# EAGLE design open-lux-B (EAGLE 6.5.0)
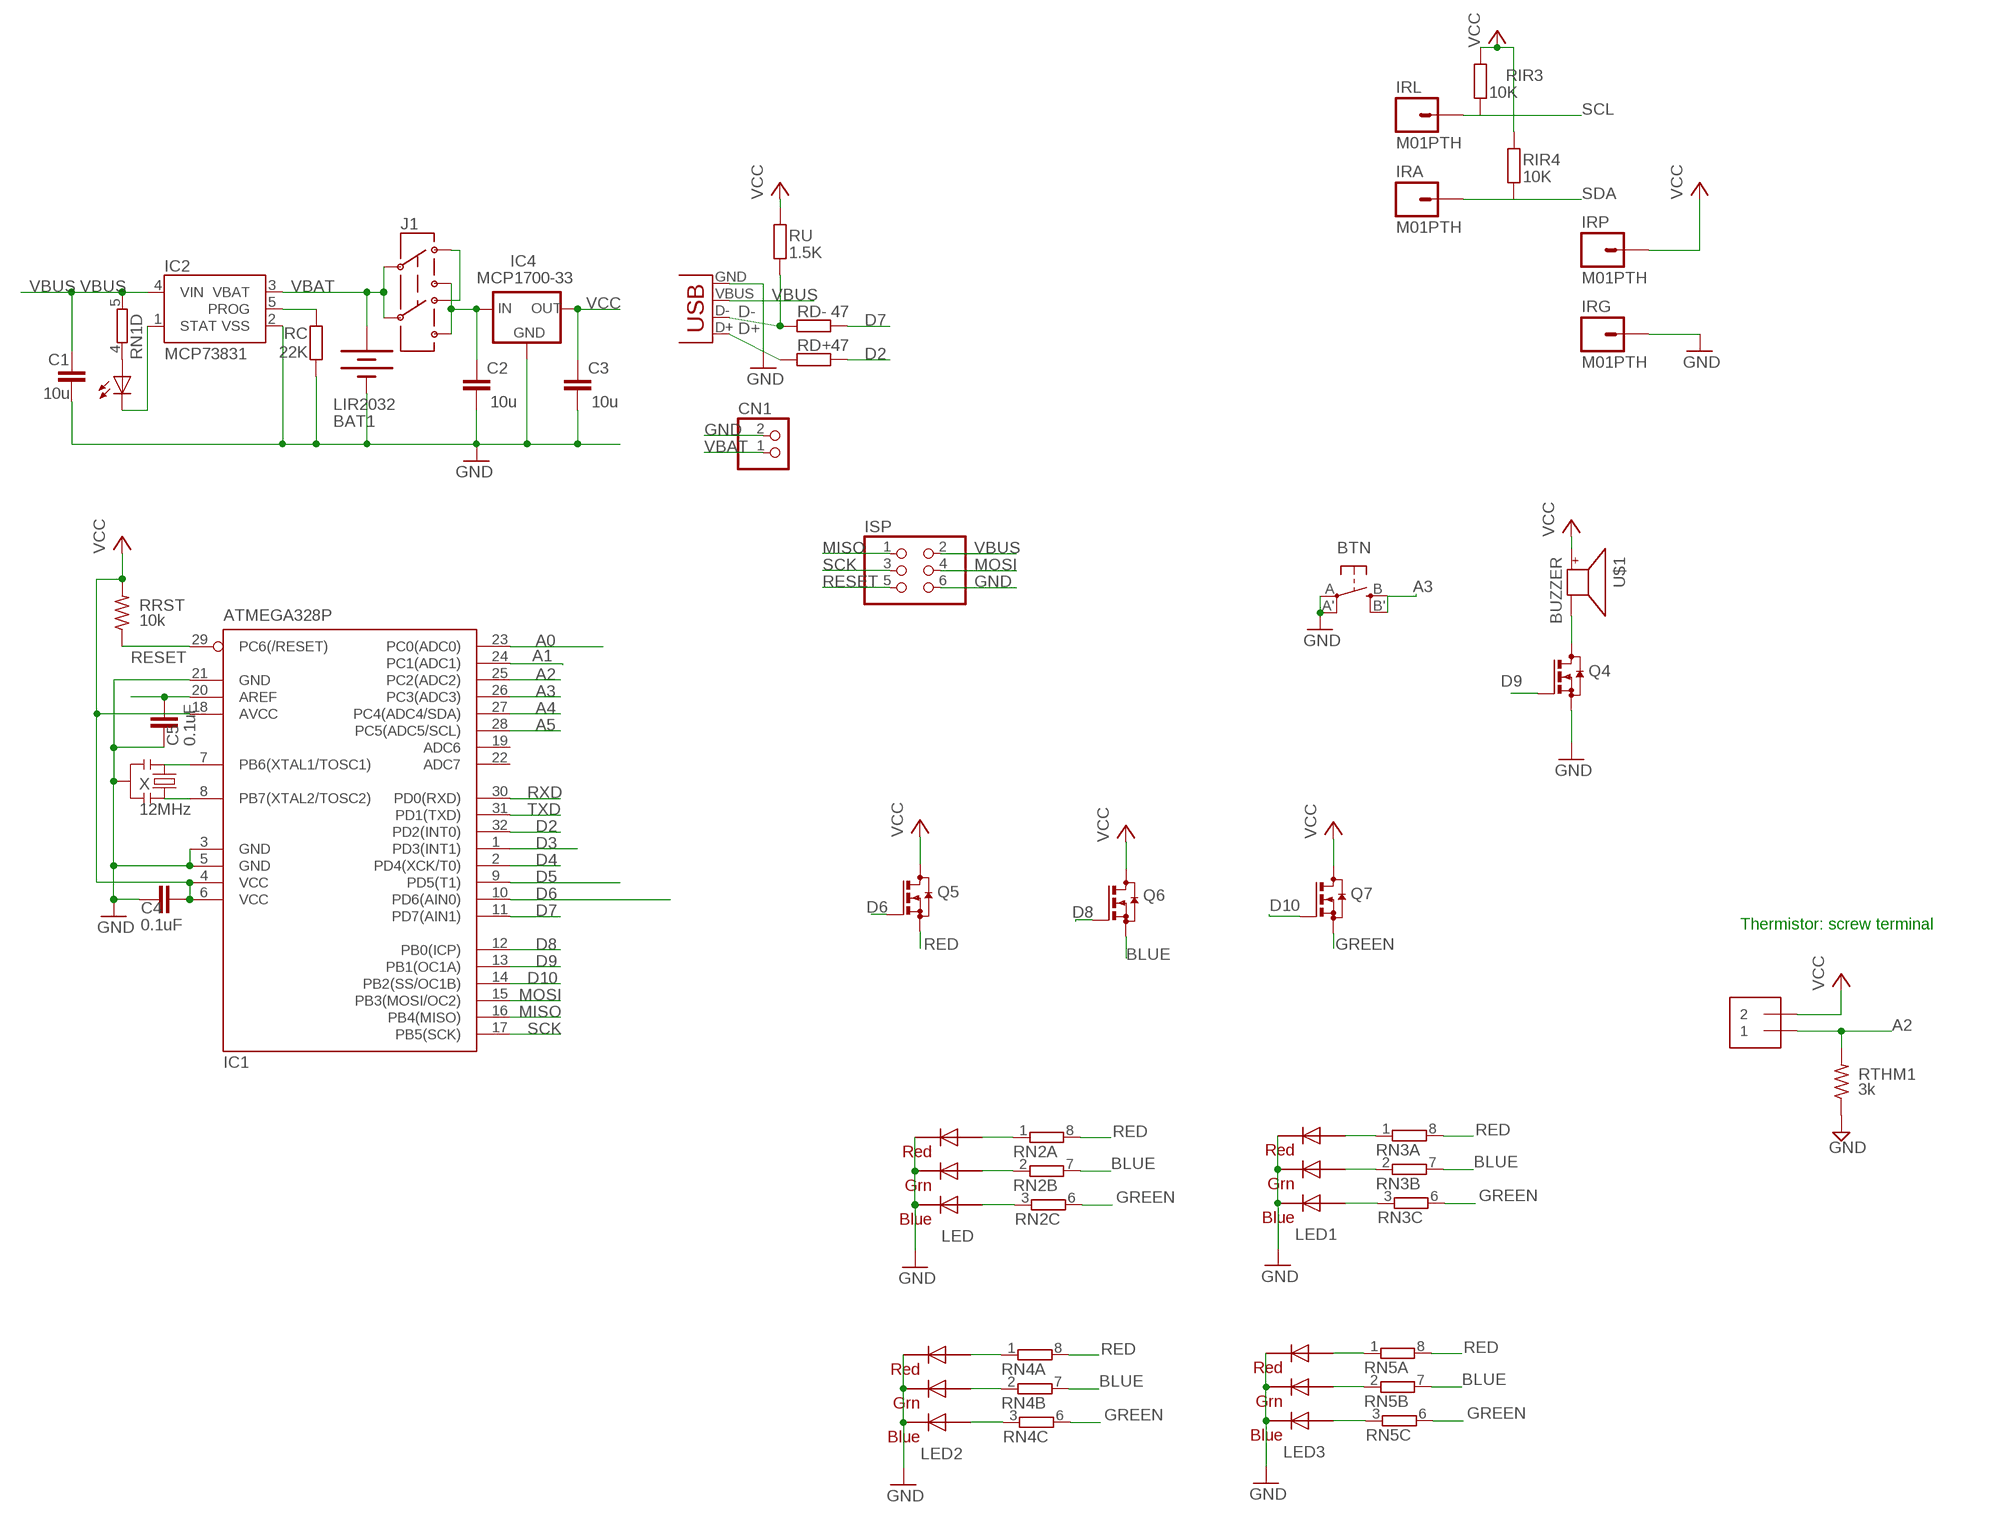
[diagram p0: schematic, sheet 1, part 1 of 2]
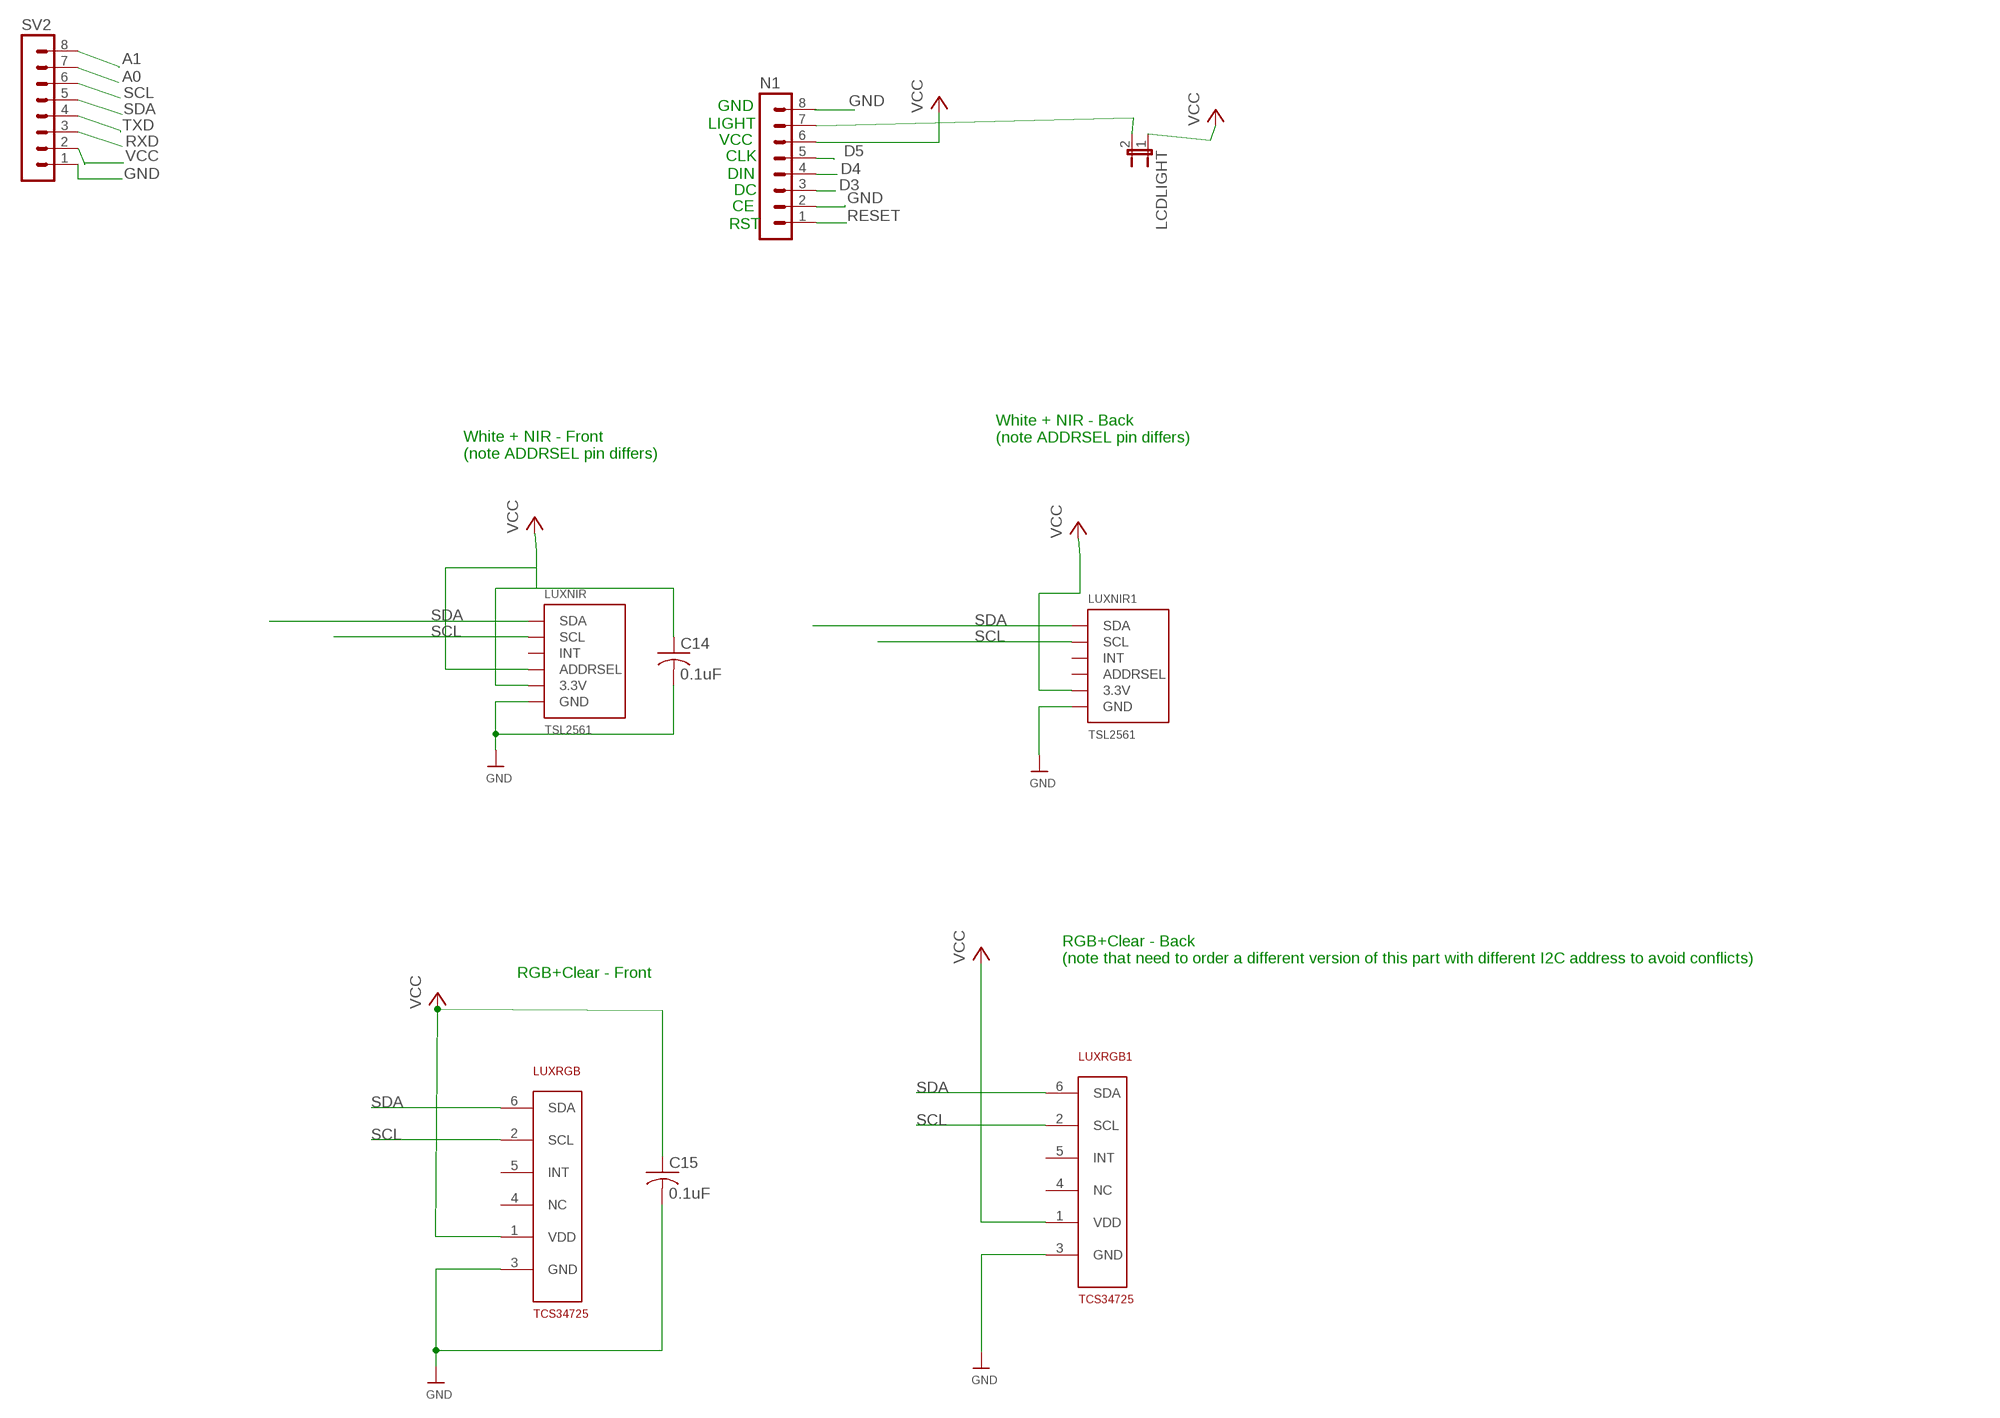
[diagram p1: schematic, sheet 1, part 2 of 2]

## Parts
BAT1  LIR2032  BATTERYBATTCOM_20MM_PTH_SMT  [BATTCOM_20MM_PTH_SMT]
BTN  EVQQ2  [EVQ-Q2]
C1  10u  C-EUC0805  [C0805]
C2  10u  C-EUC0805  [C0805]
C3  10u  C-EUC0805  [C0805]
C4  0.1uF  C-EUC0805  [C0805]
C5  0.1uF  C-EUC0805  [C0805]
C14  0.1uF  C-USC0805  [C0805]
C15  0.1uF  C-USC0805  [C0805]
CHG  0805  LEDCHIPLED_0805  [CHIPLED_0805]
CN1  JST_2PIN-SMT-RA  [JST-PH-2-SMT-RA]
IC1  ATMEGA328P  MEGA8-AI  [TQFP32-08]
IC2  MCP73831  [SOT23-5]
IC4  MCP1700-33  MCP1700SOT233  [SOT23]
IRA  M01PTH  [1X01]
IRG  M01PTH  [1X01]
IRL  M01PTH  [1X01]
IRP  M01PTH  [1X01]
ISP  PINHD-2X3  [2X03]
J1  AYZ0202  [AYZ0202]
LCDLIGHT  JP1E  [JP1]
LED  RGBLED5050  [RGBLED5050]
LED1  RGBLED5050  [RGBLED5050]
LED2  RGBLED5050  [RGBLED5050]
LED3  RGBLED5050  [RGBLED5050]
LUXNIR  TSL2561  [TSL2561_FN@1]
LUXNIR1  TSL2561  [TSL2561_FN@1]
LUXRGB  TCS34725  [DFN-6]
LUXRGB1  TCS34725  [DFN-6]
N1  MA08-1  [MA08-1]
Q4  BSS123  [SOT23]
Q5  BSS123  [SOT23]
Q6  BSS123  [SOT23]
Q7  BSS123  [SOT23]
RC  22K  R-EU_R0805  [R0805]
RD+  47  R-EU_R0805  [R0805]
RD-  47  R-EU_R0805  [R0805]
RIR3  10K  R-EU_R0805  [R0805]
RIR4  10K  R-EU_R0805  [R0805]
RN1  4R-NEXB38V  [EXB38V]
RN2  4R-NEXB38V  [EXB38V]
RN3  4R-NEXB38V  [EXB38V]
RN4  4R-NEXB38V  [EXB38V]
RN5  4R-NEXB38V  [EXB38V]
RRST  10k  R-US_R0805  [R0805@1]
RTHM1  3k  R-US_R0805  [R0805@1]
RU  1.5K  R-EU_R0805  [R0805]
SV2  MA08-1  [MA08-1]
THM1  1X2-3.5MM  [1X2-3.5MM]
U$1  BUZZER  [SMT-8585-BUZZER]
X  12MHz  RESONATORSMD  [RESONATOR-SMD]
X1  USBSMD  [USB-MINIB]

## Nets
A0: IC1.23(PC0(ADC0)) SV2.7
A1: IC1.24(PC1(ADC1)) SV2.8
A2: IC1.25(PC2(ADC2)) RTHM1.2 THM1.1
A3: BTN.B'(S1) BTN.B(S) IC1.26(PC3(ADC3))
A4: IC1.27(PC4(ADC4/SDA))
A5: IC1.28(PC5(ADC5/SCL))
AREF: C5.2 IC1.20(AREF)
BLUE: Q6.2(S) RN2.7 RN3.7 RN4.7 RN5.7
D2: IC1.32(PD2(INT0)) RD+.2
D3: IC1.1(PD3(INT1)) N1.3
D4: IC1.2(PD4(XCK/T0)) N1.4
D5: IC1.9(PD5(T1)) N1.5
D6: IC1.10(PD6(AIN0)) Q5.1(G)
D7: IC1.11(PD7(AIN1)) RD-.2
D8: IC1.12(PB0(ICP)) Q6.1(G)
D9: IC1.13(PB1(OC1A)) Q4.1(G)
D10: IC1.14(PB2(SS/OC1B)) Q7.1(G)
D+: RD+.1 X1.D+
D-: RD-.1 RU.1 X1.D-
GND: BAT1.P$1(-) BTN.A'(P1) BTN.A(P) C1.2 C2.2 C3.2 C4.1 C5.1 C14.2 C15.2 CN1.2 IC1.3(GND) IC1.5(GND) IC1.21(GND) IC2.2(VSS) IC4.1(GND) IRG.1 ISP.6 LED1.4(BLUE_C) LED1.5(RED_C) LED1.6(GREEN_C) LED2.4(BLUE_C) LED2.5(RED_C) LED2.6(GREEN_C) LED3.4(BLUE_C) LED3.5(RED_C) LED3.6(GREEN_C) LED.4(BLUE_C) LED.5(RED_C) LED.6(GREEN_C) LUXNIR1.VSS(GND) LUXNIR.VSS(GND) LUXRGB1.3(GND) LUXRGB.3(GND) N1.2 N1.8 Q4.2(S) RC.1 RTHM1.1 SV2.1 X1.GND X.2
GREEN: Q7.2(S) RN2.6 RN3.6 RN4.6 RN5.6
MISO: IC1.16(PB4(MISO)) ISP.1
MOSI: IC1.15(PB3(MOSI/OC2)) ISP.4
N$1: J1.3 J1.6
N$2: IC1.7(PB6(XTAL1/TOSC1)) X.1
N$3: IC1.8(PB7(XTAL2/TOSC2)) X.3
N$4: LED.3(BLUE_A) RN2.3
N$5: CHG.C IC2.1(STAT)
N$6: IC2.5(PROG) RC.2
N$7: Q4.3(D) U$1.-
N$8: LCDLIGHT.2 N1.7
N$9: LED.1(GREEN_A) RN2.2
N$10: CHG.A RN1.4
N$11: LED.2(RED_A) RN2.1
N$12: LED1.3(BLUE_A) RN3.3
N$13: LED1.1(GREEN_A) RN3.2
N$14: LED1.2(RED_A) RN3.1
N$15: LED2.3(BLUE_A) RN4.3
N$16: LED2.1(GREEN_A) RN4.2
N$17: LED2.2(RED_A) RN4.1
N$18: LED3.3(BLUE_A) RN5.3
N$19: LED3.1(GREEN_A) RN5.2
N$20: LED3.2(RED_A) RN5.1
RED: Q5.2(S) RN2.8 RN3.8 RN4.8 RN5.8
RESET: IC1.29(PC6(/RESET)) ISP.5 N1.1 RRST.1
RXD: IC1.30(PD0(RXD)) SV2.3
SCK: IC1.17(PB5(SCK)) ISP.3
SCL: IRL.1 LUXNIR1.CLK(SCL) LUXNIR.CLK(SCL) LUXRGB1.2(SCL) LUXRGB.2(SCL) RIR3.1 SV2.6
SDA: IRA.1 LUXNIR1.DATA(SDA) LUXNIR.DATA(SDA) LUXRGB1.6(SDA) LUXRGB.6(SDA) RIR4.1 SV2.5
TXD: IC1.31(PD1(TXD)) SV2.4
VBAT: BAT1.P$2(+) CN1.1 IC2.3(VBAT) J1.2 J1.5
VBUS: C1.1 IC2.4(VIN) ISP.2 RN1.5 X1.VBUS
VCC: C3.1 C4.2 C14.1 C15.1 IC1.4(VCC) IC1.6(VCC) IC1.18(AVCC) IC4.2(OUT) IRP.1 LCDLIGHT.1 LUXNIR1.VDD(3.3V) LUXNIR.ADR(ADDRSEL) LUXNIR.VDD(3.3V) LUXRGB1.1(VDD) LUXRGB.1(VDD) N1.6 Q5.3(D) Q6.3(D) Q7.3(D) RIR3.2 RIR4.2 RRST.2 RU.2 SV2.2 THM1.2 U$1.+
VDD: C2.1 IC4.3(IN) J1.1 J1.4
Unconnected: IC1.19(ADC6) IC1.22(ADC7) LUXNIR1.ADR(ADDRSEL) LUXNIR1.INT LUXNIR.INT LUXRGB1.4(NC) LUXRGB1.5(INT) LUXRGB.4(NC) LUXRGB.5(INT) RN1.1 RN1.2 RN1.3 RN1.6 RN1.7 RN1.8 RN2.4 RN2.5 RN3.4 RN3.5 RN4.4 RN4.5 RN5.4 RN5.5

## Notes on the sheet
- GND
- LIGHT
- VCC
- CLK
- DIN
- DC
- CE
- RST
- White + NIR - Back
  (note ADDRSEL pin differs)
- White + NIR - Front
  (note ADDRSEL pin differs)
- Thermistor: screw terminal
- RGB+Clear - Back 
  (note that need to order a different version of this part with different I2C address to avoid conflicts)
- RGB+Clear - Front

## Library data of the parts
BAT1 = SparkFunNew:BATTERY: Battery Holders Various common sizes : AA, AAA, 20mm coin cell and 12mm coin cell.
BTN = adafruit:EVQQ2: SMT 6mm switch, EVQQ2 series http://www.ladyada.net/library/eagle
C1-C3 = resistor:C-EU: CAPACITOR, European symbol
C4 C5 = rcl:C-EU: CAPACITOR, European symbol
C14 C15 = adafruit:C-US: CAPACITOR, American symbol
CHG = led:LED: LED OSRAM: - CHIPLED LG R971, LG N971, LY N971, LG Q971, LY Q971, LO R971, LY R971 LH N974, LH R974 LS Q976, LO Q976, LY Q976 LO Q996 - Hyper CHIPLED LW Q18S LB Q993, LB Q99A, LB R99A - SideLED LS A670, LO A670, LY A670, LG A670, LP A670 LB A673, LV A673, LT A673, LW A673 LH A674 LY A675 LS A676, LA A676, LO A676, LY A676, LW A676 LS A679, LY A679, LG A679 - Hyper Micro SIDELED® LS Y876, LA Y876, LO Y876, LY Y876 LT Y87S - SmartLED LW L88C, LW L88S LB L89C, LB L89S, LG L890 LS L89K, LO L89K, LY L89K LS L896, LA L896, LO L896, LY L896 - TOPLED LS T670, LO T670, LY T670, LG T670, LP T670 LSG T670, LSP T670, LSY T670, LOP T670, LYG T670 LG T671, LOG T671, LSG T671 LB T673, LV T673, LT T673, LW T673 LH T674 LS T676, LA T676, LO T676, LY T676, LB T676, LH T676, LSB T676, LW T676 LB T67C, LV T67C, LT T67C, LS T67K, LO T67K, LY T67K, LW E67C LS E67B, LA E67B, LO E67B, LY E67B, LB E67C, LV E67C, LT E67C LW T67C LS T679, LY T679, LG T679 LS T770, LO T770, LY T770, LG T770, LP T770 LB T773, LV T773, LT T773, LW T773 LH T774 LS E675, LA E675, LY E675, LS T675 LS T776, LA T776, LO T776, LY T776, LB T776 LHGB T686 LT T68C, LB T68C - Hyper Mini TOPLED® LB M676 - Mini TOPLED Santana® LG M470 LS M47K, LO M47K, LY M47K Source: http://www.osram.convergy.de LUXEON: - LUMILED® LXK2-PW12-R00, LXK2-PW12-S00, LXK2-PW14-U00, LXK2-PW14-V00 LXK2-PM12-R00, LXK2-PM12-S00, LXK2-PM14-U00 LXK2-PE12-Q00, LXK2-PE12-R00, LXK2-PE12-S00, LXK2-PE14-T00, LXK2-PE14-U00 LXK2-PB12-K00, LXK2-PB12-L00, LXK2-PB12-M00, LXK2-PB14-N00, LXK2-PB14-P00, LXK2-PB14-Q00 LXK2-PR12-L00, LXK2-PR12-M00, LXK2-PR14-Q00, LXK2-PR14-R00 LXK2-PD12-Q00, LXK2-PD12-R00, LXK2-PD12-S00 LXK2-PH12-R00, LXK2-PH12-S00 LXK2-PL12-P00, LXK2-PL12-Q00, LXK2-PL12-R00 Source: www.luxeon.com KINGBRIGHT: KA-3528ASYC Source: www.kingbright.com
CN1 = adafruit:JST_2PIN: JST 2-Pin Connectors of various flavors SMT-RA (S2B-PH-SM4) 4UConnector #17311 SMT (B2B-PH-SM4) THM-RA (S2B-PH) THM (B2B-PH)
IC1 = atmel:MEGA8: MICROCONTROLLER 8 Kbytes FLASH, 1 kbytes SRAM, 512 bytes EEPROM, USART, 6-channel 10 bit ADC, 2-channel 8 bit ADC Pin compatible with Atmega48, ATMega88, ATMega168 Source: avr.lbr; MPN: ATMEGA8-16AU; OC_FARNELL: 9171371; OC_NEWARK: 73M8863
IC2 = SparkFunNew:MCP73831: Microchip's MCP73831 Miniature single cell, fully integrated Li-Ion, Li-polymer charge management controller http://ww1.microchip.com/downloads/en/DeviceDoc/21984a.pdf
IC4 = adafruit:MCP1700: VOLTAGE REGULATOR
IRA IRG IRL IRP = SparkFun-Connectors:M01: Header 1 Standard 1-pin 0.1" header. Use with straight break away headers (SKU : PRT-00116), right angle break away headers (PRT-00553), swiss pins (PRT-00743), machine pins (PRT-00117), and female headers (PRT-00115).
ISP = pinhead:PINHD-2X3: PIN HEADER
J1 = SparkFunNew:AYZ0202: SPDT Slide Switch Simple SMD single-pull double-throw slide switch. Good for less than 350mA power switch, switching UARTs between devices, etc. Spark Fun Electronics SKU : COM-00597
LCDLIGHT = jumper:JP1E: JUMPER
LED LED1-LED3 = adafruit:RGBLED: For 5050 RGB LEDs, the order of the LEDs may vary from one manufacturer to another!
LUXNIR LUXNIR1 = microbuilder:TSL2561: TSL2561 Light-To-Digital Sensor Mouser Part Numbers: CS (obsolete): 856-TSL2561CS DFN (cheapest): 856-TSL2561FN
LUXRGB LUXRGB1 = dwbLibrary:TCS34725
N1 SV2 = con-lstb:MA08-1: PIN HEADER; OC_FARNELL: unknown; OC_NEWARK: unknown
Q4-Q7 = transistor-small-signal:BSS123: N-CHANNEL MOS FET
RC RD+ RD- RIR3 RIR4 RU = rcl:R-EU_: RESISTOR, European symbol
RN1-RN5 = resistor-dil:4R-N: Array Chip Resistor Source: RS Component / Phycomp; OC_FARNELL: unknown; OC_NEWARK: unknown
RRST RTHM1 = rcl:R-US_: RESISTOR, American symbol
THM1 = adafruit:1X2: 3.5mm Terminal block http://www.ladyada.net/library/pcb/eaglelibrary.html
U$1 = adafruit:BUZZER
X = SparkFunNew:RESONATOR: Resonator Small SMD resonator. This is the itty bitty 10/20MHz resonators with built in caps. CSTCE10M0G55 and CSTCE20M0V53. Footprint has been reviewed closely but hasn't been tested yet.
X1 = SparkFun:USB: USB Connectors USB-B-PTH is fully proven SKU : PRT-00139 USB-miniB is fully proven SKU : PRT-00587 USB-A-PCB is untested. USB-A-H is throughly reviewed, but untested. Spark Fun Electronics SKU : PRT-00437 USB-B-SMT is throughly reviewed, but untested. Needs silkscreen touching up. USB-A-S has not been used/tested USB-MB-H has not been used/tested

## Net classes
0 default: width 0.203 mm, clearance 0.203 mm
1 power: width 0.254 mm, clearance 0.203 mm

## Board
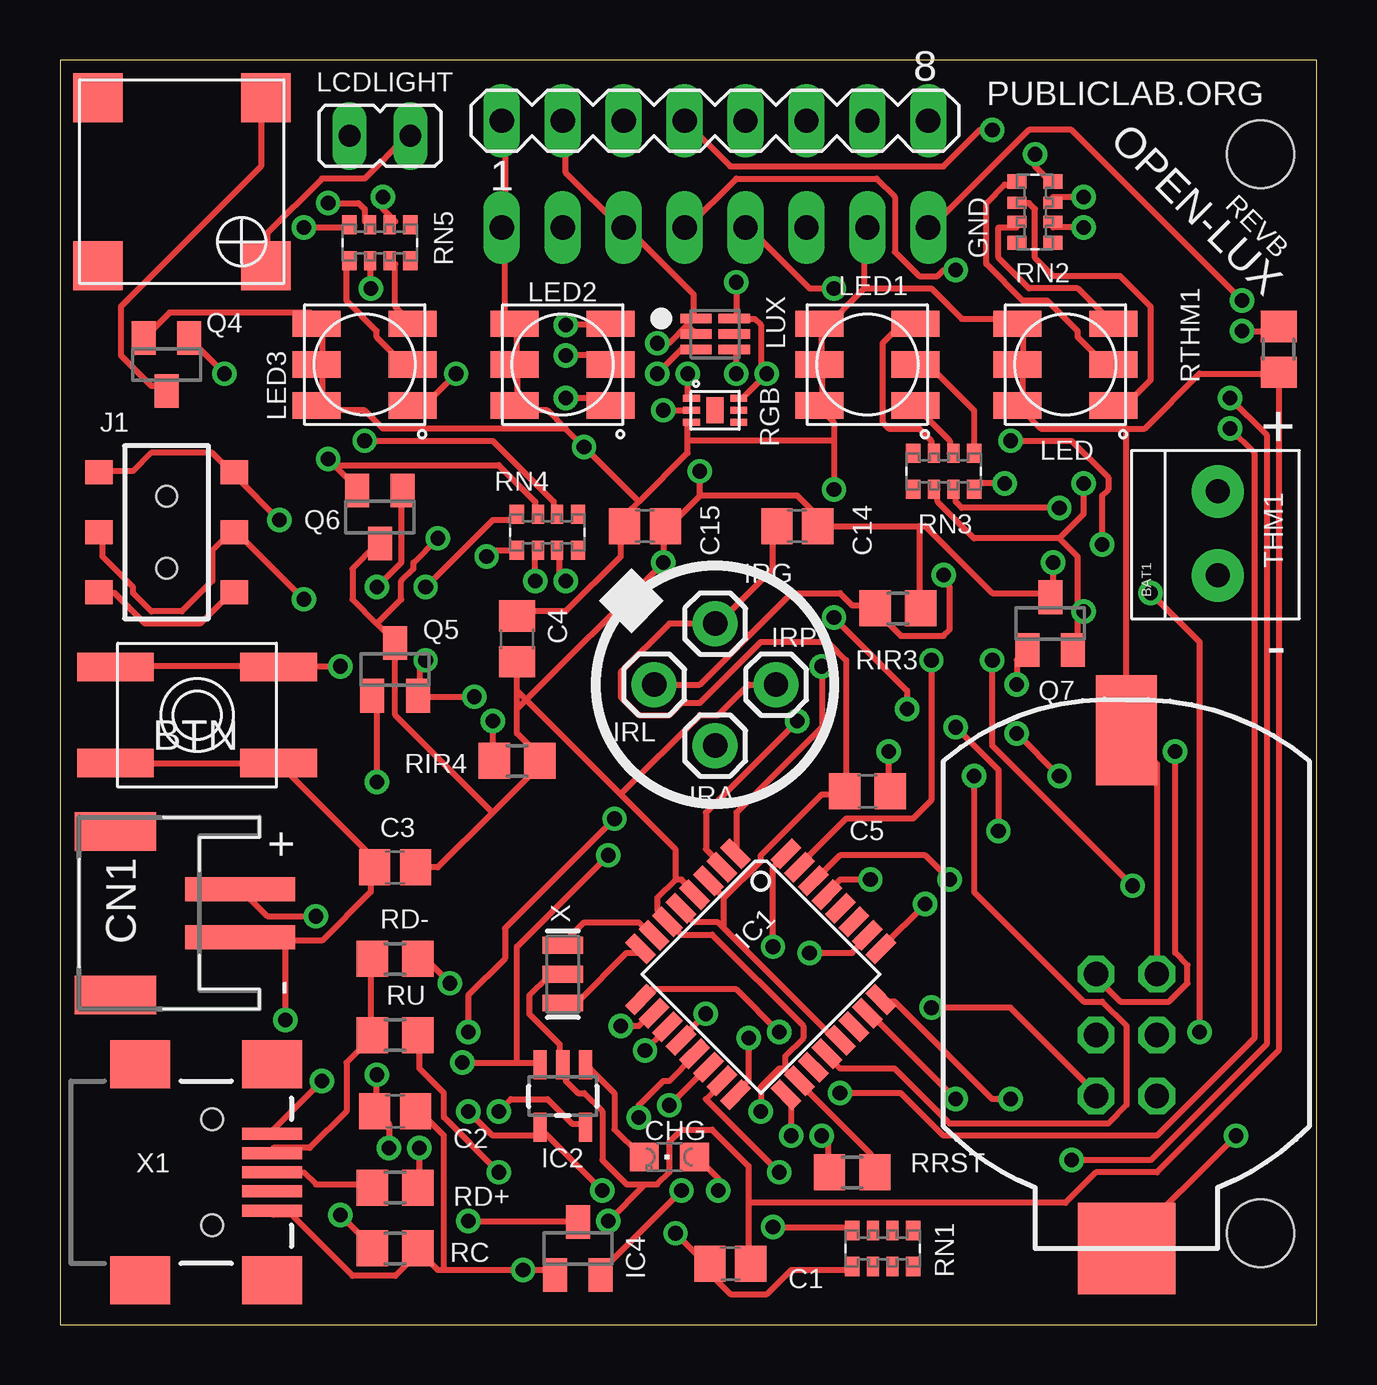
[diagram p2: board, top side]
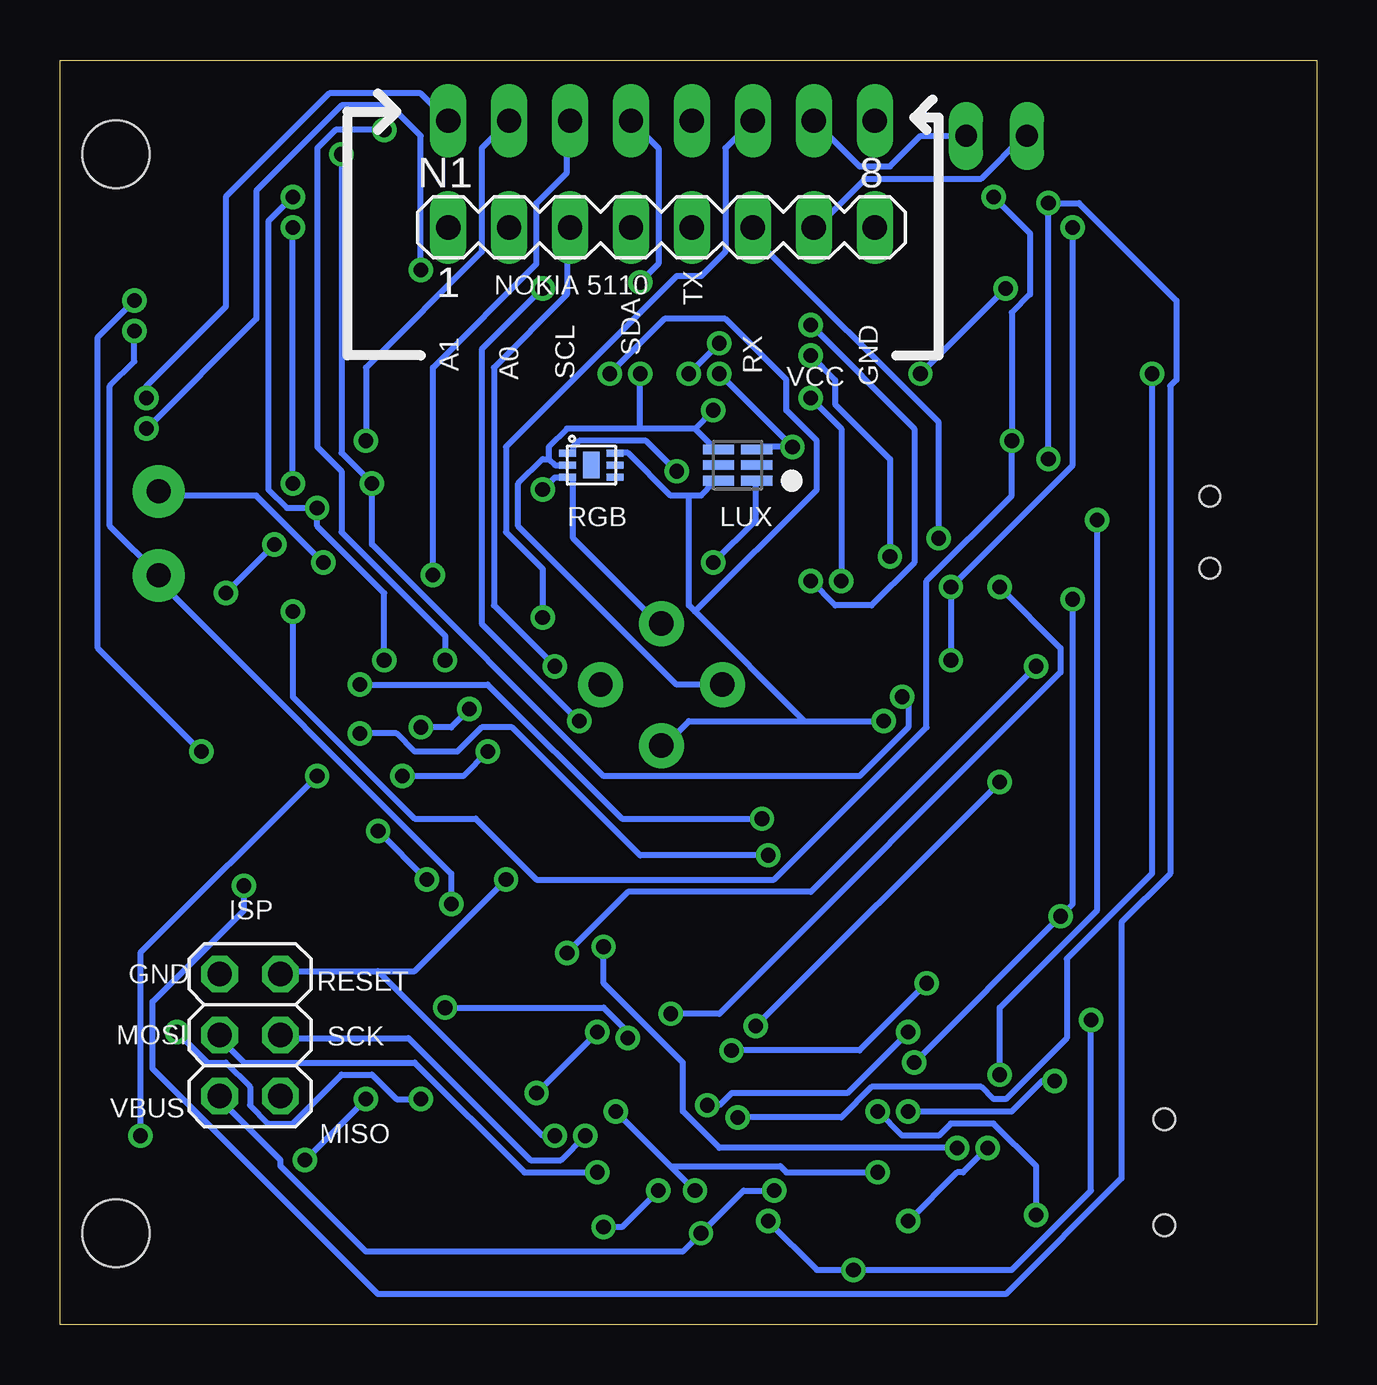
[diagram p3: board, bottom side, seen from below]

Size 52.38 x 52.7 mm. Coordinates in mm from the lower left corner, seen from the top.
Outline: 0,0 52.38,0 52.38,52.7 0,52.7 0,0
Copper layers (1*16): Top 0.035mm / dielectric 1.5mm / Bottom 0.035mm
Design rules "default": minimum track width 10mil, minimum drill 24mil, track to track 8mil, track to pad 8mil, pad to pad 8mil, via to via 8mil, smd to smd 8mil, copper to edge 40mil, drill to drill 8mil, minimum pad ring 10mil, minimum via ring 8mil, stop-mask expansion 4mil, vias tented up to drill 0mil, thermal gap 10mil
Holes 2.8 mm at 50.04,3.81 50.04,48.77

### Footprints (pad centres in the part's own frame; a part is rotated, then mirrored left to right if it is on the bottom)
BATTCOM_20MM_PTH_SMT = smd 4.572 x 2.54: P$1 0,0 | smd 3.81 x 4.064: P$2 21.59,0
EVQ-Q2 = smd 3.2 x 1.2: A -3.4,-2; A' 3.4,-2; B -3.4,2; B' 3.4,2
C0805 = smd 1.3 x 1.5: 1 -0.85,0; 2 0.85,0
C0805' = smd 1.3 x 1.5: 1 -0.95,0; 2 0.95,0
CHIPLED_0805 = smd 1.2 x 1.2: A 0,-1.05; C 0,1.05
JST-PH-2-SMT-RA = smd 1 x 4.6: 1 1,-3.7; 2 -1,-3.7 | smd 1.6 x 3.4: NC1 -3.4,1.5; NC2 3.4,1.5
TQFP32-08 = smd 1.27 x 0.559: 1 -4.293,2.8; 2 -4.293,2; 3 -4.293,1.2; 4 -4.293,0.4; 5 -4.293,-0.4; 6 -4.293,-1.2; 7 -4.293,-2; 8 -4.293,-2.8; 17 4.293,-2.8; 18 4.293,-2; 19 4.293,-1.2; 20 4.293,-0.4; 21 4.293,0.4; 22 4.293,1.2; 23 4.293,2; 24 4.293,2.8 | smd 0.559 x 1.27: 9 -2.8,-4.293; 10 -2,-4.293; 11 -1.2,-4.293; 12 -0.4,-4.293; 13 0.4,-4.293; 14 1.2,-4.293; 15 2,-4.293; 16 2.8,-4.293; 25 2.8,4.293; 26 2,4.293; 27 1.2,4.293; 28 0.4,4.293; 29 -0.4,4.293; 30 -1.2,4.293; 31 -2,4.293; 32 -2.8,4.293
SOT23-5 = smd 0.55 x 1.2: 1 -0.95,-1.3; 2 0,-1.3; 3 0.95,-1.3; 4 0.95,1.3; 5 -0.95,1.3
SOT23 = smd 1 x 1.4: 1 -0.95,-1.1; 2 0.95,-1.1; 3 0,1.1
1X01 = drill 1.016 pad 1.88: 1 0,0
2X03 = drill 1.016 octagon: 1 -2.54,-1.27; 2 -2.54,1.27; 3 0,-1.27; 4 0,1.27; 5 2.54,-1.27; 6 2.54,1.27
AYZ0202 = smd 1 x 1.15: 1 -2.5,2.825; 2 0,2.825; 3 2.5,2.825; 4 -2.5,-2.825; 5 0,-2.825; 6 2.5,-2.825 | hole 0.85: 1.5,0; -1.5,0
JP1 = drill 0.914 long: 1 0,-1.27; 2 0,1.27
RGBLED5050 = smd 2 x 1.1: 1 -2,1.7; 2 -2,0; 3 -2,-1.7; 4 2,-1.7; 5 2,0; 6 2,1.7
TSL2561_FN@1 = smd 1.3 x 0.4: ADR -0.8,0; CLK 0.8,-0.65; DATA 0.8,0.65; INT 0.8,0; VDD -0.8,0.65; VSS -0.8,-0.65
DFN-6 = smd 0.28 x 0.7: 1 -0.5,-0.988; 2 0,-0.988; 3 0.5,-0.988; 4 0.5,0.988; 5 0,0.988; 6 -0.5,0.988 | smd 1.1 x 0.7: P$1 0,0
MA08-1 = drill 1.016 long: 1 -8.89,0; 2 -6.35,0; 3 -3.81,0; 4 -1.27,0; 5 1.27,0; 6 3.81,0; 7 6.35,0; 8 8.89,0
R0805 = smd 1.3 x 1.5: 1 -0.95,0; 2 0.95,0
EXB38V = smd 0.6 x 0.8: 1 -1.275,-0.75; 4 1.275,-0.75; 5 1.275,0.75; 8 -1.275,0.75 | smd 0.5 x 0.8: 2 -0.4,-0.75; 3 0.4,-0.75; 6 0.4,0.75; 7 -0.4,0.75
R0805@1 = smd 1.3 x 1.5: 1 -0.95,0; 2 0.95,0
1X2-3.5MM = drill 1 pad 2.184: 1 1.8,0; 2 -1.7,0
SMT-8585-BUZZER = smd 2.05 x 2.05: + -3.5,-3.5; - 3.5,-3.5; NC1 -3.5,3.5; NC2 3.5,3.5
RESONATOR-SMD = smd 0.7 x 1.7: 1 -1.2,0; 2 0,0; 3 1.2,0
USB-MINIB = smd 2.5 x 0.5: D+ 2.5,0; D- 2.5,0.8; GND 2.5,-1.6; ID 2.5,-0.8; VBUS 2.5,1.6 | smd 2.5 x 2: GND@1 -3,-4.5; GND@2 -3,4.5; GND@3 2.5,4.5; GND@4 2.5,-4.5 | hole 0.9: 0,2.2; 0,-2.2

### Placement (x,y rotation side)
BAT1  44.45,24.77 270 top
BTN  5.71,25.4 0 top
C1  27.94,2.54 0 top
C2  13.97,8.89 0 top
C3  13.97,19.05 180 top
C4  0.1uF  [C0805']  19.05,28.57 270 top
C5  0.1uF  [C0805']  33.66,22.23 0 top
C14  30.73,33.27 180 top
C15  24.38,33.27 180 top
CHG  25.4,6.99 90 top
CN1  3.81,17.14 90 top
IC1  29.21,14.61 315 top
IC2  20.95,9.53 180 top
IC4  21.59,3.17 0 top
IRA  27.3,24.13 0 top
IRG  27.3,29.21 0 top
IRL  24.77,26.67 0 top
IRP  29.84,26.67 0 top
ISP  44.45,12.06 90 bottom
J1  4.45,33.02 270 top
LCDLIGHT  13.34,49.53 90 top
LED  41.91,40.01 180 top
LED1  33.66,40.01 180 top
LED2  20.95,40.01 180 top
LED3  12.7,40.01 180 top
LUXNIR  27.3,41.27 0 top
LUXNIR1  24.13,35.81 180 bottom
LUXRGB  27.3,38.1 270 top
LUXRGB1  30.23,35.81 270 bottom
N1  27.3,45.72 0 bottom
Q4  4.45,40.01 180 top
Q5  13.97,27.3 0 top
Q6  13.34,33.66 180 top
Q7  41.27,29.21 0 top
RC  13.97,3.17 180 top
RD+  13.97,5.71 0 top
RD-  13.97,15.24 0 top
RIR3  34.92,29.84 0 top
RIR4  19.05,23.5 0 top
RN1  34.29,3.17 180 top
RN2  40.64,46.35 270 top
RN3  36.83,35.56 180 top
RN4  20.32,33.02 0 top
RN5  13.34,45.09 0 top
RRST  33.02,6.35 0 top
RTHM1  50.8,40.64 90 top
RU  13.97,12.06 0 top
SV2  27.3,50.16 0 top
THM1  48.26,33.02 270 top
U$1  5.08,47.62 90 top
X  20.95,14.61 270 top
X1  6.35,6.35 0 top

### Tracks (layer width: path | path; a pad name or v marks a point on that pad's centre or on a via)
A0  (via drill 0.61)
  Top 0.254: v37.34,9.4 33.78,12.95 IC1.23 | v47.5,12.19 47.5,28.45 v45.47,30.48 | v43.43,32.51 43.43,34.54 43.69,34.8 43.69,35.31 42.16,36.83 v39.62,36.83
  Bottom 0.254: v37.34,9.4 38.35,9.4 39.37,10.41 40.64,10.41 42.67,8.38 43.69,8.38 44.45,9.14 44.45,9.91 45.47,10.92 46.23,10.92 v47.5,12.19 | v43.43,32.51 v45.47,30.48 | v39.62,36.83 39.62,39.88 34.8,44.7 34.8,49.02 SV2.7
A1  (via drill 0.61)
  Top 0.254: v39.62,9.4 38.86,9.4 34.8,13.46 34.29,13.46 IC1.24 | v42.16,6.86 45.47,6.86 50.29,11.68 50.29,37.08 v48.77,38.61
  Bottom 0.254: v42.16,6.86 v39.62,9.4 | v48.77,38.61 48.77,39.12 45.47,42.42 45.47,46.99 41.15,51.31 37.34,51.31 SV2.8
A2  (via drill 0.61)
  Top 0.254: v36.07,17.53 34.29,15.75 IC1.25 | v49.28,41.4 50.8,41.4 RTHM1.2
  Bottom 0.254: v36.07,17.53 36.07,18.8 48.26,30.99 THM1.1 48.26,31.24 50.29,33.27 50.29,39.12 49.28,40.13 v49.28,41.4
A3  (via drill 0.61)
  Top 0.254: v31.24,15.49 33.02,15.49 33.53,16 IC1.26 | v11.68,27.43 9.14,27.43 BTN.B' 8.89,27.43 2.54,27.43 BTN.B
  Bottom 0.254: v31.24,15.49 28.7,18.03 21.08,18.03 v11.68,27.43
AREF  (via drill 0.61)
  Top 0.254: v38.1,22.86 38.1,18.03 42.67,13.46 43.43,13.46 44.45,12.45 44.45,9.14 43.69,8.38 37.08,8.38 34.8,10.67 32.51,10.67 32,11.18 IC1.20 | v34.54,23.88 34.54,22.35 C5.2
  Bottom 0.254: v38.1,22.86 35.56,22.86 v34.54,23.88
BLUE  (via drill 0.61)
  Top 0.254: v41.66,34.04 37.59,34.04 37.34,34.29 37.34,34.8 RN3.7 | v42.67,46.99 41.4,46.99 RN2.7 | v11.18,46.74 12.45,46.74 12.7,46.48 12.7,45.97 RN5.7 | 11.43,35.81 12.45,34.8 Q6.2 | 11.43,35.81 18.29,35.81 19.81,34.29 19.81,33.78 RN4.7 | 11.43,35.81 v11.18,36.07 | v38.86,27.69 38.86,24.13 v44.7,18.29
  Bottom 0.254: v42.67,46.99 43.69,45.97 43.69,34.8 42.93,34.04 v41.66,34.04 41.66,33.27 38.86,30.48 v38.86,27.69 | v11.18,36.07 v11.18,46.74 9.91,46.74 5.84,42.67 5.84,39.37 6.1,39.12 6.1,18.8 8.13,16.76 8.13,6.1 12.95,1.27 39.12,1.27 48.51,10.67 48.51,13.46 44.7,17.27 v44.7,18.29
D2  (via drill 0.61)
  Top 0.254: v29.72,15.75 29.72,19.05 30.23,19.56 IC1.32 | v14.99,7.37 14.99,5.84 RD+.2
  Bottom 0.254: v29.72,15.75 29.72,14.22 26.42,10.92 26.42,8.89 24.89,7.37 v14.99,7.37
D3  (via drill 0.61)
  Top 0.254: v31.75,27.43 31.75,24.89 28.19,21.34 28.19,19.81 IC1.1
  Bottom 0.254: v31.75,27.43 34.29,29.97 34.29,39.88 31.24,42.93 31.24,45.72 N1.3
D4  (via drill 0.61)
  Top 0.254: v30.73,25.15 26.92,21.34 26.92,19.81 27.43,19.3 IC1.2 | v32.26,43.18 31.24,43.18 28.7,45.72 N1.4
  Bottom 0.254: v30.73,25.15 34.8,29.21 34.8,40.64 v32.26,43.18
D5  (via drill 0.61)
  Top 0.254: v29.97,12.19 28.19,13.97 24.64,13.97 24.38,13.72 IC1.9 | v32.51,9.65 35.05,9.65 36.83,7.87 45.72,7.87 49.78,11.94 49.78,36.32 v48.77,37.34 | v37.34,43.94 36.83,43.94 36.58,43.69 35.81,43.69 34.8,44.7 34.8,46.99 34.04,47.75 28.19,47.75 26.16,45.72 N1.5
  Bottom 0.254: v32.51,9.65 v29.97,12.19 | v48.77,37.34 44.2,41.91 44.2,47.24 40.64,50.8 38.61,50.8 37.34,49.53 v37.34,43.94
D6  (via drill 0.61)
  Top 0.254: v23.37,12.45 24.13,12.45 24.64,12.95 IC1.10 | v13.21,22.61 13.21,26.16 Q5.1
  Bottom 0.254: v13.21,22.61 v23.37,12.45
D7  (via drill 0.61)
  Top 0.254: v24.38,11.43 25.15,12.19 IC1.11 | v16.26,14.22 15.24,15.24 RD-.2
  Bottom 0.254: v24.38,11.43 19.05,11.43 v16.26,14.22
D8  (via drill 0.61)
  Top 0.254: v26.92,12.95 25.91,11.94 IC1.12 | v13.21,30.73 14.22,31.75 14.22,34.54 Q6.1
  Bottom 0.254: v26.92,12.95 24.89,12.95 10.67,27.18 10.67,28.19 v13.21,30.73
D9  (via drill 0.61)
  Top 0.254: v24.13,8.64 24.13,9.14 25.15,10.16 25.4,10.16 26.42,11.18 IC1.13 | v6.86,39.62 5.59,40.89 Q4.1
  Bottom 0.254: v24.13,8.64 19.81,8.64 18.54,9.91 13.97,9.91 13.46,9.4 12.95,9.4 10.41,11.94 10.41,15.24 6.86,18.8 v6.86,39.62
D10  (via drill 0.61)
  Top 0.254: v25.4,9.14 26.92,10.67 IC1.14 | v17.02,12.19 17.02,13.72 18.54,15.24 18.54,16.51 v23.11,21.08 | v39.88,26.67 39.88,27.69 40.13,27.94 Q7.1
  Bottom 0.254: v25.4,9.14 24.89,9.14 24.38,9.65 19.56,9.65 v17.02,12.19 | v23.11,21.08 28.96,21.08 34.54,26.67 v39.88,26.67
D+
  Top 0.254: X1.D+ 10.16,6.35 10.67,5.84 12.95,5.84 RD+.1
D-
  Top 0.254: RD-.1 12.95,15.24 12.95,12.19 RU.1 12.95,11.94 11.94,10.92 11.94,8.89 10.41,7.37 8.89,7.37 X1.D-
GND  (via drill 0.61)
  Top 0.254: 12.95,19.05 12.95,19.56 9.14,23.37 BTN.A' 8.89,23.37 2.54,23.37 BTN.A | 9.4,16 10.92,16 12.95,18.03 12.95,19.05 | 9.4,16 7.62,16 CN1.2 9.4,16 | 12.95,19.05 C3.2 | 16,2.29 15.75,2.29 14.99,3.05 | 16,2.29 v19.3,2.29 20.57,2.29 IC4.1 | 16,2.29 16,7.87 14.99,8.89 C2.2 | 14.99,3.05 13.97,2.03 12.19,2.03 9.65,4.57 8.89,4.57 X1.GND | 14.99,3.05 RC.1 | X.2 20.83,14.48 20.32,14.48 19.56,13.72 19.56,12.95 20.83,11.68 20.83,10.92 IC2.2 21.08,10.67 21.08,10.16 21.59,9.65 21.84,9.65 22.61,8.89 22.61,6.86 23.62,5.84 24.38,5.84 | 28.7,5.08 28.7,6.6 27.18,8.13 25.91,8.13 25.4,7.62 25.4,6.35 24.89,5.84 24.38,5.84 | 28.7,5.08 28.7,2.54 C1.2 | 24.38,5.84 v22.86,4.32 | v9.4,12.7 9.4,16 | Q4.2 3.56,41.15 4.57,42.16 10.41,42.16 10.67,41.91 LED3.4 10.92,41.66 10.92,40.13 LED3.5 10.92,39.88 10.92,38.35 LED3.6 10.92,38.1 12.7,38.1 13.46,37.34 21.08,37.34 | 18.54,45.72 18.54,50.04 SV2.1 | 26.16,36.83 26.16,36.32 24.13,34.29 | 26.16,36.83 26.16,37.59 LUXRGB.3 | 24.13,34.29 23.62,33.78 23.62,33.27 C15.2 23.37,33.27 23.37,32 21.08,29.72 19.05,29.72 C4.1 | 24.13,34.29 v21.84,36.58 21.08,37.34 | v24.89,39.62 25.91,40.64 26.42,40.64 LUXNIR.VSS | 21.08,37.34 20.32,38.1 19.05,38.1 LED2.6 19.05,38.35 19.05,39.88 LED2.5 19.05,40.13 19.05,41.66 LED2.4 18.8,41.91 18.54,42.16 18.54,45.72 | 18.54,45.72 N1.8 | 50.8,39.62 47.5,39.62 45.21,37.34 44.45,37.34 | 44.45,37.34 40.89,37.34 40.13,38.1 LED.6 40.13,38.35 40.13,39.88 LED.5 40.13,40.13 40.13,41.66 LED.4 39.88,41.91 37.59,41.91 36.32,43.18 33.53,43.18 | ISP.6 45.72,23.37 44.45,24.64 BAT1.P$1 44.45,37.34 | 27.69,16.51 32.51,11.68 IC1.21 | 27.69,16.51 27.43,16.76 26.42,16.76 25.91,17.27 IC1.5
  Top 0.254: 27.69,17.78 27.18,18.29 IC1.3 | 27.69,16.51 27.69,17.78 | 27.69,17.78 29.21,19.3 29.21,19.56 31.75,22.1 32.51,22.1 C5.1 32.77,22.35 32.77,27.69 32,28.45 29.21,28.45 26.67,25.91 25.91,25.91 25.4,25.4 24.13,25.4 23.37,26.16 23.37,27.18 25.4,29.21 IRG.1 27.43,29.21 29.72,31.5 29.72,33.27 C14.2 | 31.75,41.4 31.75,40.13 LED1.5 31.75,39.88 31.75,38.35 LED1.6 31.75,38.1 32.26,37.59 32.26,36.83 | 31.75,41.4 31.75,41.66 LED1.4 31.75,41.4 | 33.53,43.18 33.53,45.72 N1.2 | 31.75,41.4 33.53,43.18 | 32.26,36.83 v32.26,34.8 | 32.26,36.83 26.16,36.83 | 28.7,5.08 41.91,5.08 43.18,6.35 45.72,6.35 50.8,11.43 50.8,39.62 | 50.8,39.62 RTHM1.1
  Bottom 0.254: v22.86,4.32 20.83,2.29 v19.3,2.29 12.7,2.29 9.4,5.59 v9.4,12.7 | LUXNIR1.VSS 23.11,36.58 v21.84,36.58 v24.89,39.62 | IRG.1 27.43,29.21 30.99,32.77 30.99,35.31 LUXRGB1.3 31.24,35.31 31.75,35.31 v32.26,34.8
GREEN  (via drill 0.61)
  Top 0.254: v12.7,36.83 18.03,36.83 20.57,34.29 20.57,33.78 RN4.6 | v13.46,46.99 13.46,46.48 13.97,45.97 RN5.6 | 41.66,32.77 38.1,32.77 36.58,34.29 36.58,34.8 RN3.6 | 41.66,32.77 42.42,32 42.42,29.72 | 42.42,29.72 42.42,28.19 Q7.2 | v42.67,45.72 41.4,45.72 RN2.6 | v42.67,35.05 42.67,33.78 41.66,32.77 | 42.42,29.72 v42.67,29.72
  Bottom 0.254: v13.46,46.99 11.94,45.47 11.94,42.93 12.7,42.16 v12.7,36.83 12.7,34.54 16.26,30.99 16.26,24.89 22.61,18.54 32.51,18.54 35.05,21.08 37.59,21.08 42.67,26.16 v42.67,29.72 | v42.67,35.05 v42.67,45.72
MISO  (via drill 0.61)
  Top 0.254: v28.7,11.94 28.7,10.16 28.19,9.65 IC1.16 | v36.32,13.21 39.62,13.21 43.18,9.65 ISP.1
  Bottom 0.254: v28.7,11.94 28.7,12.19 29.72,13.21 v36.32,13.21
MOSI  (via drill 0.61)
  Top 0.254: v29.97,6.35 26.92,9.4 27.43,9.91 IC1.15
  Bottom 0.254: v29.97,6.35 33.02,6.35 37.59,10.92 44.7,10.92 45.72,11.94 ISP.4
N$1
  Top 0.254: J1.6 1.78,30.48 2.29,30.48 3.56,29.21 5.84,29.21 7.11,30.48 J1.3
N$2
  Top 0.254: IC1.7 24.64,16.26 24.13,16.76 21.84,16.76 21.08,16 X.1
N$3
  Top 0.254: IC1.8 24.13,15.49 23.62,15.49 21.59,13.46 21.08,13.46 X.3
N$4
  Top 0.254: RN2.3 39.88,45.72 39.12,45.72 39.12,44.45 40.39,43.18 42.42,43.18 43.69,41.91 LED.3
N$5
  Top 0.254: CHG.C 24.13,7.11 23.11,8.13 23.11,9.65 22.1,10.67 IC2.1
N$6  (via drill 0.61)
  Top 0.254: v18.29,8.89 18.8,9.4 20.32,9.4 21.34,8.38 21.84,8.38 IC2.5 | v11.68,4.57 12.95,3.3 RC.2
  Bottom 0.254: v18.29,8.89 17.27,7.87 15.75,7.87 15.24,8.38 13.46,8.38 11.68,6.6 v11.68,4.57
N$7
  Top 0.254: Q4.3 4.32,39.12 3.81,39.12 2.54,40.39 2.54,42.42 8.38,48.26 8.38,51.05 U$1.-
N$8
  Bottom 0.254: LCDLIGHT.2 12.19,49.53 13.97,47.75 18.8,47.75 20.83,45.72 N1.7
N$9
  Top 0.254: RN2.2 40.13,46.74 40.39,46.74 40.64,46.48 40.64,44.45 41.4,43.69 44.2,43.69 45.47,42.42 45.47,39.37 44.45,38.35 43.94,38.35 LED.1
N$10  (via drill 0.61)
  Top 0.254: v29.72,4.06 32.77,4.06 RN1.4 | v27.43,5.59 27.43,6.1 26.67,6.86 CHG.A
  Bottom 0.254: v29.72,4.06 28.96,4.06 v27.43,5.59
N$11
  Top 0.254: RN2.1 39.88,47.5 39.37,47.5 38.61,46.74 38.61,44.2 40.13,42.67 41.15,42.67 42.42,41.4 42.42,41.15 43.69,39.88 LED.2
N$12
  Top 0.254: RN3.3 36.32,36.32 36.32,36.83 35.81,37.34 34.54,37.34 34.29,37.59 34.29,40.89 35.05,41.66 35.56,41.66 LED1.3
N$13
  Top 0.254: RN3.2 37.08,36.32 37.08,36.83 35.81,38.1 LED1.1
N$14
  Top 0.254: RN3.1 38.1,36.32 38.1,38.1 36.32,39.88 35.81,39.88 LED1.2
N$15  (via drill 0.61)
  Top 0.254: v21.08,30.99 20.83,31.24 20.83,32.26 RN4.3 | v21.08,41.66 22.86,41.66 LED2.3
  Bottom 0.254: v21.08,30.99 20.07,29.97 18.54,29.97 16.76,31.75 16.76,37.34 v21.08,41.66
N$16  (via drill 0.61)
  Top 0.254: v19.81,30.99 19.81,32.26 RN4.2 | v21.08,38.61 22.61,38.61 22.86,38.35 LED2.1
  Bottom 0.254: v19.81,30.99 19.81,37.34 v21.08,38.61
N$17  (via drill 0.61)
  Top 0.254: v17.78,32 18.03,32.26 18.8,32.26 RN4.1 | v21.08,40.39 22.61,40.39 22.86,40.13 LED2.2
  Bottom 0.254: v17.78,32 17.78,36.07 20.07,38.35 20.07,39.37 v21.08,40.39
N$18
  Top 0.254: RN5.3 13.97,44.2 13.97,42.42 14.48,41.91 LED3.3
N$19  (via drill 0.61)
  Top 0.254: v12.95,43.18 12.95,44.2 RN5.2 | v16.51,39.62 15.24,38.35 14.73,38.35 LED3.1
  Bottom 0.254: v16.51,39.62 v12.95,43.18
N$20
  Top 0.254: RN5.1 11.94,44.2 11.94,42.67 13.21,41.4 13.21,41.15 14.48,39.88 LED3.2
RED  (via drill 0.61)
  Top 0.254: v39.37,35.05 38.35,35.05 RN3.8 | v40.64,48.77 40.64,48.26 41.15,47.75 RN2.8 | v10.16,45.72 11.94,45.72 RN5.8 | v15.24,30.73 18.03,33.53 18.8,33.53 RN4.8 | v15.24,27.69 14.99,27.43 14.99,26.42 Q5.2 14.99,26.16 v17.27,26.16
  Bottom 0.254: v40.64,48.77 40.64,36.32 v39.37,35.05 39.37,32.51 29.72,22.86 19.05,22.86 17.02,24.89 17.02,25.91 v17.27,26.16 | v10.16,45.72 10.16,35.81 v15.24,30.73 v15.24,27.69
RESET  (via drill 0.61)
  Top 0.254: v33.78,18.54 32.51,18.54 32,18.03 IC1.29 | v31.75,7.87 32,7.62 32,6.35 RRST.1 | v49.28,42.67 42.16,49.78 40.39,49.78 36.32,45.72 N1.1 | v46.48,23.88 46.48,15.49 46.99,14.99 46.99,14.22 46.23,13.46 44.2,13.46 43.18,14.48 ISP.5
  Bottom 0.254: v33.78,18.54 37.59,14.73 39.12,14.73 | 39.12,14.73 43.18,14.73 ISP.5 | v31.75,7.87 32.26,7.87 39.12,14.73 | v49.28,42.67 50.8,41.15 50.8,28.19 v46.48,23.88
RXD  (via drill 0.61)
  Top 0.254: v37.08,18.54 36.07,19.56 32.51,19.56 31.5,18.54 IC1.30 | v39.12,20.57 39.12,23.11 v37.34,24.89 | v35.31,25.65 35.31,26.42 v32.26,29.46
  Bottom 0.254: v39.12,20.57 v37.08,18.54 | v37.34,24.89 36.07,24.89 v35.31,25.65 | v32.26,29.46 32.26,31.5 33.78,33.02 33.78,36.58 26.67,43.69 25.65,43.69 24.64,44.7 24.64,49.02 SV2.3
SCK  (via drill 0.61)
  Top 0.254: v30.48,7.87 30.48,9.4 IC1.17
  Bottom 0.254: v30.48,7.87 31.5,6.86 32.77,6.86 37.85,11.94 43.18,11.94 ISP.3
SCL  (via drill 0.61)
  Top 0.254: v25.15,38.1 LUXRGB.2 | v28.19,39.62 28.19,40.64 LUXNIR.CLK | IRL.1 26.67,26.67 30.48,30.48 32.51,30.48 33.02,29.97 33.78,29.97 RIR3.1 34.04,29.72 35.05,28.7 36.83,28.7 37.08,28.96 37.08,30.73 36.83,30.99 v36.83,31.24
  Bottom 0.254: LUXRGB1.2 31.75,35.81 32,36.07 | 32,36.07 32,36.58 31.24,37.34 28.19,37.34 | 25.91,37.34 28.19,37.34 | 25.91,37.34 25.15,36.58 LUXNIR1.CLK | 25.91,37.34 v25.15,38.1 | 28.19,37.34 v28.19,39.62 | v36.83,31.24 36.83,39.88 32.51,44.2 32.51,46.74 31.24,48.01 31.24,50.04 SV2.6 | 32,36.07 32.26,36.07 33.27,35.05 33.27,33.27 26.67,26.67 IRL.1
SDA  (via drill 0.61)
  Top 0.254: 29.21,39.62 29.21,41.66 28.96,41.91 28.19,41.91 | 29.21,39.62 29.21,39.37 28.45,38.61 LUXRGB.6 | v28.19,43.43 28.19,41.91 | 28.19,41.91 LUXNIR.DATA | v18.03,25.15 18.03,23.62 RIR4.1 | v29.46,39.62 29.21,39.62
  Bottom 0.254: v28.19,43.43 27.43,44.2 27.43,49.02 SV2.5 | 26.16,34.54 25.65,34.54 25.15,35.05 LUXNIR1.DATA | 26.16,34.54 26.92,34.54 28.7,36.32 29.21,36.32 LUXRGB1.6 | 21.34,25.15 26.16,25.15 27.18,24.13 IRA.1 | 21.34,25.15 v18.03,25.15 | 26.16,34.54 26.16,29.97 25.91,29.72 | 21.34,25.15 25.91,29.72 | v29.46,39.62 27.18,41.91 24.64,41.91 22.1,39.37 22.1,38.1 20.83,36.83 20.83,34.8 25.91,29.72
TXD  (via drill 0.61)
  Top 0.254: v36.32,27.69 36.32,21.84 35.56,21.08 32.77,21.08 30.99,19.3 IC1.31 | v38.86,49.78 38.35,49.78 36.83,48.26 27.94,48.26 SV2.4
  Bottom 0.254: v36.32,27.69 36.32,28.7 40.64,33.02 40.64,35.56 41.66,36.58 41.66,49.02 40.89,49.78 v38.86,49.78
VBAT  (via drill 0.61)
  Top 0.254: J1.5 1.78,33.02 1.78,32 3.05,30.73 3.05,30.48 3.81,29.72 5.08,29.72 6.35,30.99 6.35,32.26 7.11,33.02 J1.2 7.37,33.02 v10.16,30.23 | v16.76,10.92 19.05,10.92 | 19.05,10.92 19.81,10.92 IC2.3 | v10.67,17.02 8.64,17.02 7.62,18.03 CN1.1 | v49.02,7.87 44.45,3.3 BAT1.P$2 | v39.88,24.64 v41.66,22.86 | v22.86,19.56 19.05,15.75 19.05,10.92
  Bottom 0.254: v16.76,10.92 v10.67,17.02 10.16,17.53 v10.16,30.23 | v49.02,7.87 49.02,15.49 v41.66,22.86 | v39.88,24.64 38.35,24.64 37.59,23.88 35.81,23.88 34.8,24.89 33.53,24.89 28.19,19.56 v22.86,19.56
VBUS  (via drill 0.61)
  Top 0.254: RN1.5 32.77,2.29 30.48,2.29 29.46,1.27 27.94,1.27 27.18,2.03 27.18,2.54 C1.1 26.92,2.54 v25.65,3.81 | v22.61,5.59 20.32,7.87 | 20.32,7.87 20.07,8.13 IC2.4 | v10.92,10.16 8.89,8.13 X1.VBUS | v17.02,8.89 18.03,7.87 20.32,7.87
  Bottom 0.254: v22.61,5.59 23.88,5.59 v25.65,3.81 26.42,3.05 39.62,3.05 43.18,6.6 43.18,6.86 45.72,9.4 ISP.2 | v10.92,10.16 11.43,10.16 12.7,8.89 v17.02,8.89
VCC  (via drill 0.61)
  Top 0.254: 26.67,34.54 v26.67,35.56 | 26.67,34.54 25.4,33.27 C15.1 25.15,33.27 v25.15,31.75 19.05,25.65 | 32,33.27 C14.1 31.75,33.27 | 32,33.27 35.81,33.27 | 35.81,33.27 36.07,33.27 38.86,30.48 41.15,30.48 Q7.3 41.4,30.48 v41.4,31.75 | 35.81,33.27 35.81,29.97 RIR3.2 | 26.67,34.54 30.73,34.54 32,33.27 | U$1.+ 8.64,44.2 8.64,45.47 10.92,47.75 12.7,47.75 14.48,49.53 LCDLIGHT.1 | v26.16,39.62 26.16,38.61 LUXRGB.1 | v24.89,40.89 25.4,40.89 26.16,41.66 | 26.42,41.91 26.16,41.66 | 26.16,41.66 26.42,41.4 LUXNIR.ADR | 26.42,41.91 26.42,42.93 23.62,45.72 N1.6 23.37,45.72 21.08,48.01 21.08,50.04 SV2.2 | 26.42,41.91 LUXNIR.VDD | RRST.2 33.78,6.35 33.78,7.11 30.99,9.91 IC1.18 30.73,10.16 30.23,10.67 | v25.91,5.59 22.61,2.29 IC4.2 | v29.21,8.89 29.21,9.91 29.97,10.67 30.23,10.67 | v18.29,6.35 16,8.64 16,9.65 14.99,10.67 14.99,11.94 RU.2 | 13.21,29.21 12.19,30.23 12.19,31.5 13.21,32.51 Q6.3 | 13.21,29.21 13.97,28.45 Q5.3 13.97,25.4 18.03,21.34 | 25.65,18.54 24.89,17.78 24.89,17.27 25.15,17.02 IC1.6 25.4,16.76 25.91,16.26 27.18,16.26 30.99,12.45 30.99,11.94 30.23,11.18 30.23,10.67 | 25.65,18.54 25.91,18.54 26.42,18.03 IC1.4 | C3.1 15.75,19.05 18.03,21.34 | 18.03,21.34 20.07,23.37 RIR4.2 20.07,23.62 19.05,24.64 19.05,25.65 | 19.05,25.65 19.05,26.42 | 19.05,26.42 C4.2 | 25.65,18.54 25.65,19.81 23.37,22.1 | 19.05,26.42 23.37,22.1 | IRP.1 28.7,26.67 27.43,25.4 26.67,25.4 23.37,22.1 | v15.75,32.77 14.73,31.75 14.73,31.5 14.22,30.99 14.22,30.23 13.21,29.21
  Bottom 0.254: v26.67,35.56 27.94,36.83 30.73,36.83 30.99,36.58 30.99,36.32 LUXRGB1.1 | v25.15,31.75 23.37,33.53 23.37,35.05 LUXNIR1.VDD | v41.4,31.75 44.2,34.54 48.26,34.54 THM1.2 | v24.89,40.89 v26.16,39.62 | LCDLIGHT.1 16.51,49.53 17.78,48.26 19.05,48.26 SV2.2 | v29.21,8.89 26.92,6.6 | 26.92,6.6 v25.91,5.59 | v18.29,6.35 22.1,6.35 22.35,6.6 26.92,6.6 | v15.75,32.77 15.75,37.59 23.37,45.21 23.37,45.72 N1.6
VDD  (via drill 0.61)
  Top 0.254: J1.4 1.78,35.56 3.05,35.56 3.81,36.32 6.35,36.32 7.11,35.56 J1.1 7.37,35.31 v9.14,33.53 | v17.02,4.32 21.59,4.32 IC4.3 | v13.72,7.37 13.72,8.38 13.21,8.89 | 13.21,8.89 v13.21,10.41 | 13.21,8.89 C2.1
  Bottom 0.254: v17.02,4.32 14.99,6.35 14.73,6.35 v13.72,7.37 | v9.14,33.53 9.14,17.27 13.21,13.21 v13.21,10.41

### Text on the board
tPlace: PUBLICLAB.ORG | OPEN-LUX | GND | REVB | LUX | RGB | + | -
bPlace: TX | NOKIA 5110 | SCL | A1 | RX | SDA | GND | VCC | A0 | LUX | RGB | RESET | GND | SCK | MOSI | VBUS | MISO